# Altium project dAir-aster_0.0.0.2.PrjPCB
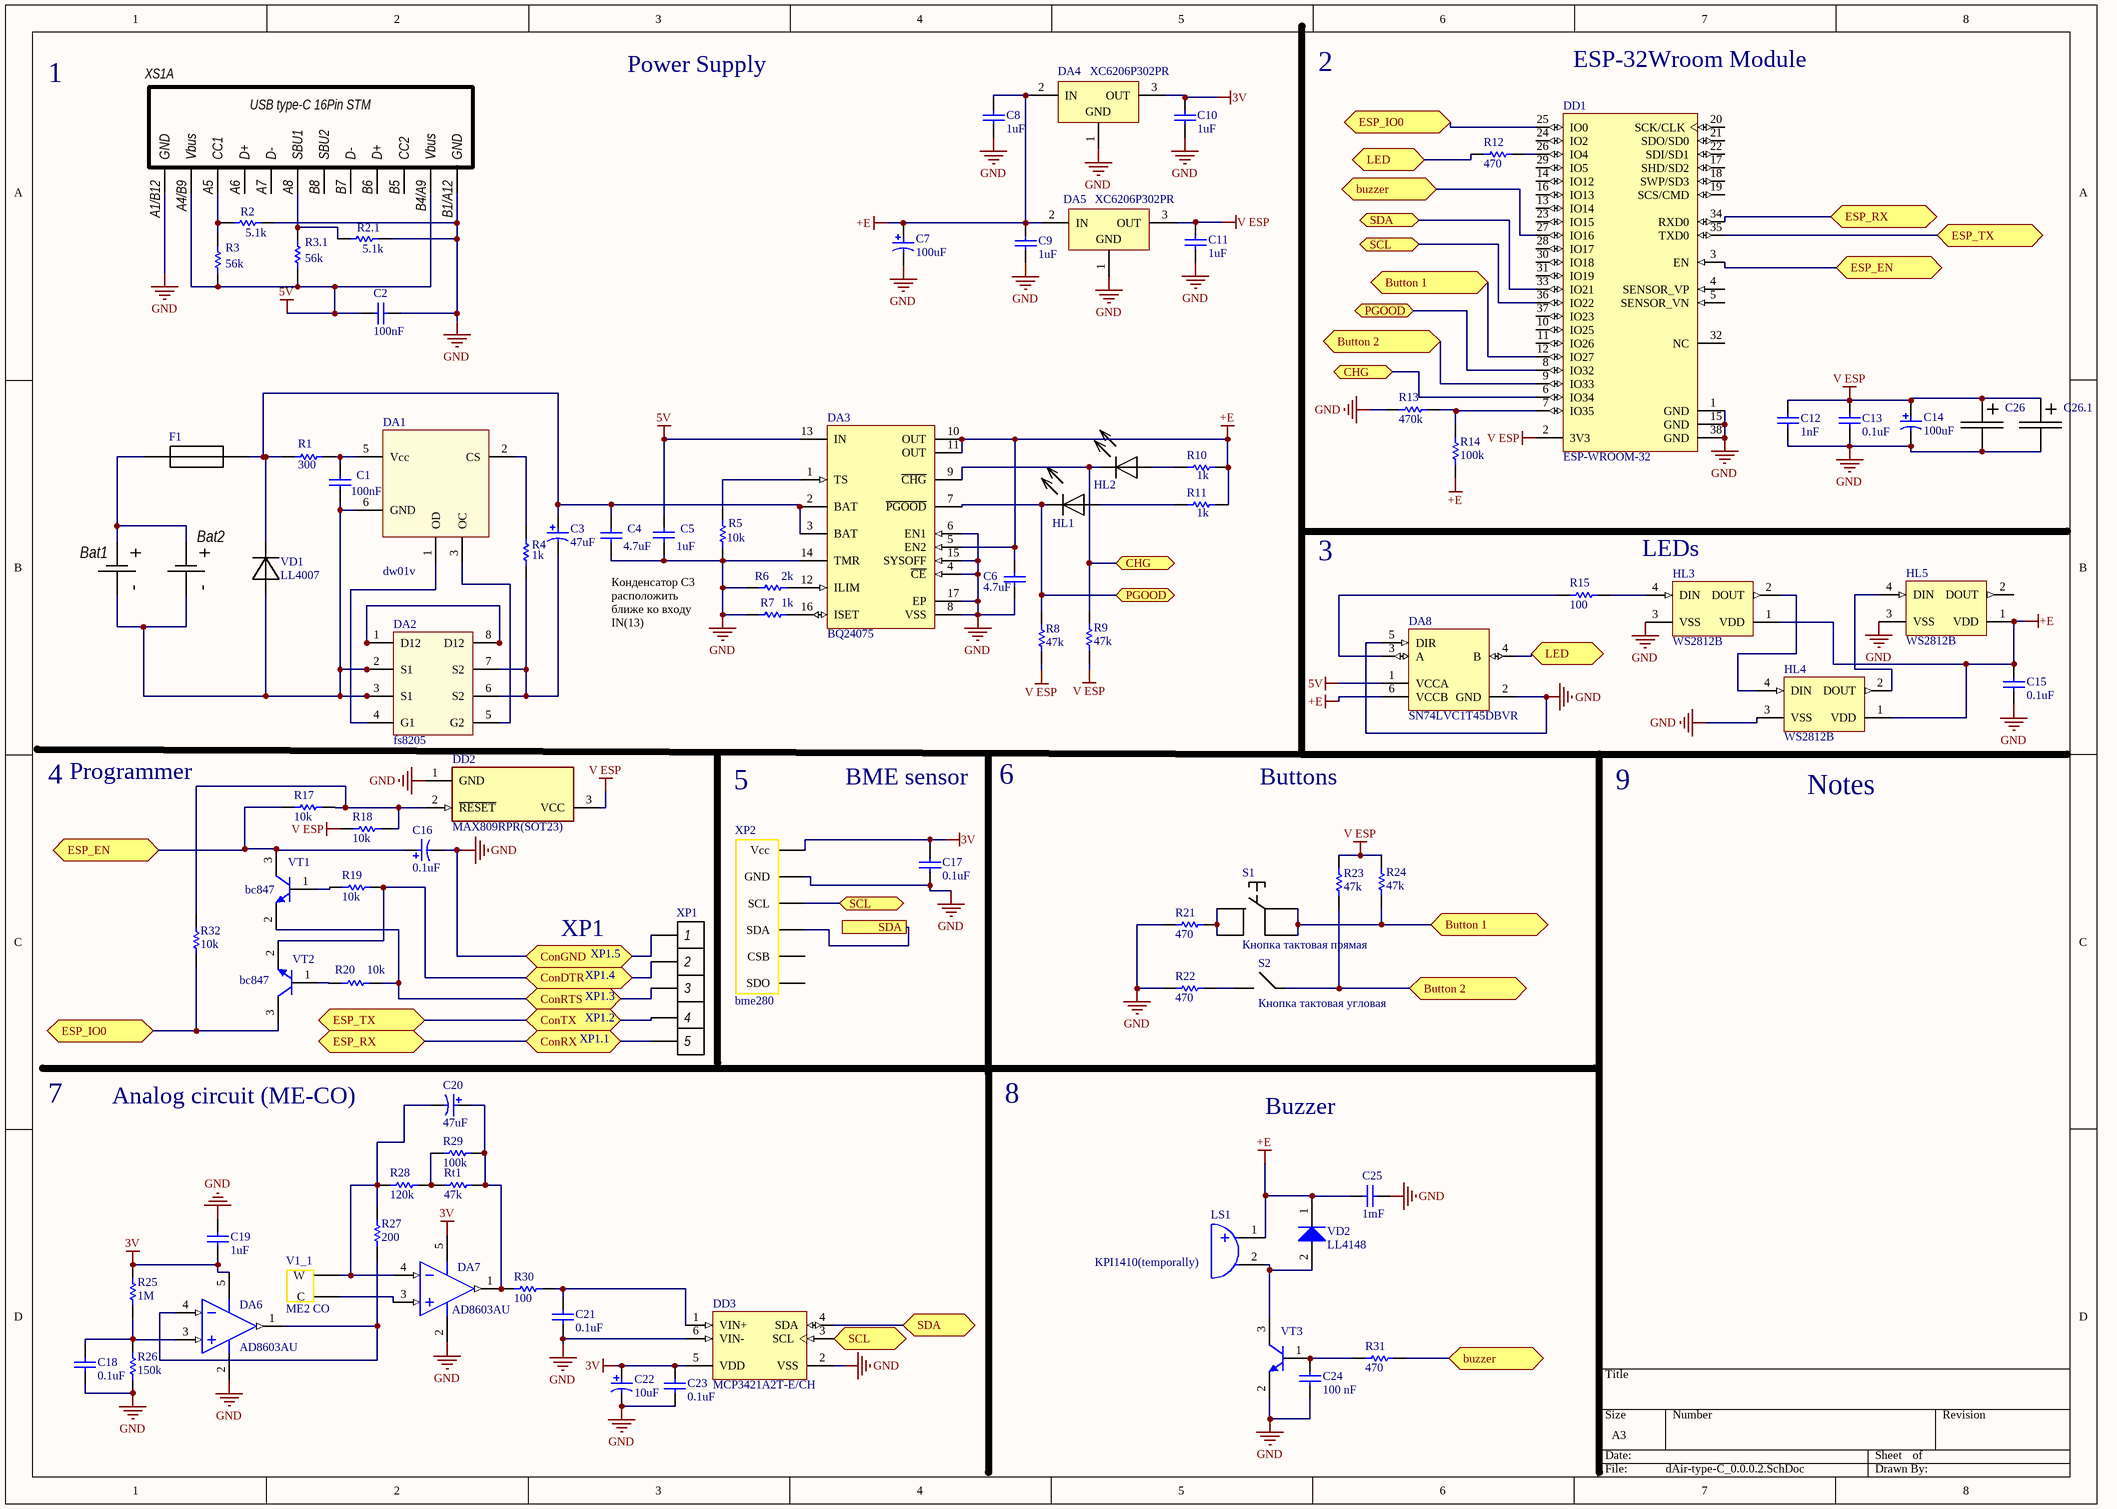
[diagram p0: dAir-type-C_0.0.0.2.SchDoc]
1 sheet, 92 parts. Net scope: flat (ports and power ports of the same name join across sheets).
Board file: dAir_0.0.0.2.PcbDoc

## Sheet dAir-type-C_0.0.0.2.SchDoc
size A3

### Parts
Bat1  *  [Bat_18650_KEYS54]  (value not drawn)
Bat2  АКБ_18650_KEYS54  [Bat_18650_KEYS54]  (value not drawn)
C1  100nF  [CAPC0805(2012)155_L]
C2  100nF  [CAPC0805(2012)155_L]
C3  47uF  [KEMT-A-3216-18-2_M]
C4  4.7uF  [CAPC0805(2012)155_L]
C5  1uF  [CAPC0805(2012)155_L]
C6  4.7uF  [CAPC0805(2012)155_L]
C7  100uF  [KEMT-A-3216-18-2_M]
C8  1uF  [CAPC0805(2012)155_L]
C9  1uF  [CAPC0805(2012)155_L]
C10  1uF  [CAPC0805(2012)155_L]
C11  1uF  [CAPC0805(2012)155_L]
C12  1nF  [CAPC0805(2012)155_L]
C13  0.1uF  [CAPC0805(2012)155_L]
C14  100uF  [KEMT-A-3216-18-2_M]
C15  0.1uF  [CAPC0805(2012)155_L]
C16  0.1uF  [KEMT-A-3216-18-2_M]
C17  0.1uF  [CAPC0805(2012)155_L]
C18  0.1uF  [CAPC0805(2012)155_L]
C19  1uF  [CAPC0805(2012)155_L]
C20  47uF  [KEMT-A-3216-18-2_M]
C21  0.1uF  [CAPC0805(2012)155_L]
C22  10uF  [KEMT-A-3216-18-2_M]
C23  0.1uF  [CAPC0805(2012)155_L]
C24  100 nF  [CAPC0805(2012)155_L]
C25  1mF  [CAPC0805(2012)155_L]
C26  Cap_tantal  [Tantal тип E]  (value not drawn)
C26.1  Cap_electrolitic  [Capacitor_radial_13x21_5mm]  (value not drawn)
DA1  dw01v  [dw01v_SOT-23-6]
DA2  fs8205  [FS8205_TSSOP-8]
DA3  BQ24075  [RGT0016C_V]
DA4  XC6206P302PR  [SOT89_N]
DA5  XC6206P302PR  [SOT89_N]
DA6  AD8603AU  [ADI-UJ-5_M]
DA7  AD8603AU  [ADI-UJ-5_M]
DA8  SN74LVC1T45DBVR  [DBV0006A_L]
DD1  ESP-WROOM-32  [OLMX-ESP-WROOM-32]
DD2  MAX809RPR(SOT23)  [FP-318-08-MFG]
DD3  MCP3421A2T-E/CH  [SOT-23-CH6_L]
F1  Fuse  [FUSE_MF-MSMF050]  (value not drawn)
HL1  HL?  [LED_SMT-3.2x1.6x1.1]  (value not drawn)
HL2  HL?  [LED_SMT-3.2x1.6x1.1]  (value not drawn)
HL3  WS2812B  [ADAI-WS2812B_V]
HL4  WS2812B  [ADAI-WS2812B_V]
HL5  WS2812B  [ADAI-WS2812B_V]
LS1  KPI1410(temporally)  [CZCY-CY-12085G-5042-2_V]
R1  300  [RESC0805(2012)_M]
R2  5.1k  [RESC0805(2012)_M]
R2.1  5.1k  [RESC0805(2012)_M]
R3  56k  [RESC0805(2012)_M]
R3.1  56k  [RESC0805(2012)_M]
R4  1k  [RESC0805(2012)_M]
R5  10k  [RESC0805(2012)_M]
R6  2k  [RESC0805(2012)_M]
R7  1k  [RESC0805(2012)_M]
R8  47k  [RESC0805(2012)_M]
R9  47k  [RESC0805(2012)_M]
R10  1k  [RESC0805(2012)_M]
R11  1k  [RESC0805(2012)_M]
R12  470  [RESC0805(2012)_M]
R13  470k  [RESC0805(2012)_M]
R14  100k  [RESC0805(2012)_M]
R15  100  [RESC0805(2012)_M]
R17  10k  [RESC0805(2012)_M]
R18  10k  [RESC0805(2012)_M]
R19  10k  [RESC0805(2012)_M]
R20  10k  [RESC0805(2012)_M]
R21  470  [RESC0805(2012)_M]
R22  470  [RESC0805(2012)_M]
R23  47k  [RESC0805(2012)_M]
R24  47k  [RESC0805(2012)_M]
R25  1M  [RESC0805(2012)_M]
R26  150k  [RESC0805(2012)_M]
R27  200  [RESC0805(2012)_M]
R28  120k  [RESC0805(2012)_M]
R29  100k  [RESC0805(2012)_M]
R30  100  [RESC0805(2012)_M]
R31  470  [RESC0805(2012)_M]
R32  10k  [RESC0805(2012)_M]
Rt1  47k  [RESC0805(2012)_M]
S1  Кнопка тактовая прямая  [Кнопка тактовая прямая SMT 4.3mm]
S2  Кнопка тактовая угловая  [Кнопка тактовая 4,3мм]
V1_1  ME2 CO  [ME2_CO]
VD1  LL4007  [MELF/DO-213AB]
VD2  LL4148  [INF-SOD323_V]
VT1  bc847  [ONSC-SOT-23-3-318-08_V]
VT2  bc847  [ONSC-SOT-23-3-318-08_V]
VT3  (no value)  [ONSC-SOT-23-3-318-08_V]
XP1  XP1  [Pin 5x2.54]  (value not drawn)
XP2  bme280  [BME680]
XS1A  CON USB_TypeC-16Pin  [USB_type_c_16P_SMT]  (value not drawn)

### Ports
Button 1 (bidir), Button 2 (bidir), buzzer (bidir), CHG (bidir), ConDTR (bidir), ConGND (bidir), ConRTS (bidir), ConRX (bidir), ConTX (bidir), ESP_EN (bidir), ESP_IO0 (bidir), ESP_RX (bidir), ESP_TX (bidir), LED (bidir), PGOOD (bidir), SCL (bidir), SDA, SDA (bidir)

### Nets
3V: C10.2 C17.2 C19.1 C22.1 C23.2 DA4.3(OUT) DA6.5(+V) DA7.5(+V) DD3.5(VDD) R25.2 XP2.1(Vcc)
5V: C2.1 C5.1 DA3.13(IN) DA8.1(VCCA) R3.2 R3.1.2 XS1A.A4/B9(Vbus) XS1A.B4/A9(Vbus)
+E: C6.1 C7.1 C8.2 C9.2 C15.2 C25.1 DA3.5(EN2) DA3.10(OUT) DA3.11(OUT) DA4.2(IN) DA5.2(IN) DA8.6(VCCB) HL3.1(VDD) HL4.1(VDD) HL5.1(VDD) LS1.1(A) R10.1 R11.1 R14.2 VD2.1(K)
GND: C2.2 C4.2 C5.2 C6.2 C7.2 C8.1 C9.1 C10.1 C11.1 C12.1 C13.1 C14.2 C15.1 C16.2 C17.1 C18.1 C19.2 C21.2 C22.2 C23.1 C24.2 C25.2 C26.2(-) C26.1.2(-) DA3.4(~{CE}) DA3.6(EN1) DA3.8(VSS) DA3.14(TMR) DA3.15(SYSOFF) DA3.17(EP) DA4.1(GND) DA5.1(GND) DA6.2(-V) DA7.2(-V) DA8.2(GND) DA8.5(DIR) DD1.1(GND) DD1.15(GND) DD1.38(GND) DD2.1(GND) DD3.2(VSS) DD3.6(VIN-) HL3.3(VSS) HL4.3(VSS) HL5.3(VSS) R2.1 R2.1.1 R5.2 R6.2 R7.2 R13.1 R21.1 R22.1 R26.1 VT3.2(E) XP1.1 XP2.2(GND) XS1A.A1/B12(GND) XS1A.B1/A12(GND) ; port ConGND
V ESP: C11.2 C12.2 C13.2 C14.1 C26.1(+) C26.1.1(+) DA5.3(OUT) DD1.2(3V3) DD2.3(VCC) R8.1 R9.1 R18.2 R23.2 R24.2
NetBat1_1: Bat1.1(Bat+) Bat2.1(Bat+) F1.1
NetBat1_2: Bat1.2(Bat-) Bat2.2(Bat-) C1.2 DA1.6(GND) DA2.2(S1) DA2.3(S1) VD1.2
NetC1_1: C1.1 DA1.5(Vcc) R1.2
NetC3_1: C3.1 C4.1 DA3.2(BAT) DA3.3(BAT) F1.2 R1.1 VD1.1
NetC3_2: C3.2 DA2.6(S2) DA2.7(S2) R4.2
NetC16_1: C16.1 DD1.3(EN) R17.2 VT1.3(C) ; port ESP_EN
NetC18_2: C18.2 DA6.3(+IN) R25.1 R26.2
NetC20_1: C20.1 DA7.1(OUT) R29.2 R30.1 Rt1.2
NetC20_2: C20.2 DA7.4(-IN) R27.2 R28.1 V1_1.1W(W)
NetC21_1: C21.1 DD3.1(VIN+) R30.2
NetC24_1: C24.1 R31.1 VT3.1(B)
NetDA1_1: DA1.1(OD) DA2.4(G1)
NetDA1_2: DA1.2(CS) R4.1
NetDA1_3: DA1.3(OC) DA2.5(G2)
NetDA2_1: DA2.1(D12) DA2.8(D12)
NetDA3_1: DA3.1(TS) R5.1
NetDA3_7: DA3.7(~{PGOOD}) DD1.8(IO32) HL1.1 R8.2 ; port PGOOD
NetDA3_9: DA3.9(~{CHG}) DD1.6(IO34) HL2.1 R9.2 ; port CHG
NetDA3_12: DA3.12(ILIM) R6.1
NetDA3_16: DA3.16(ISET) R7.1
NetDA6_1: DA6.1(OUT) DA6.4(-IN) R27.1
NetDA7_3: DA7.3(+IN) V1_1.2C(C)
NetDA8_3: DA8.3(A) R15.1
NetDA8_4: DA8.4(B) R12.1 ; port LED
NetDD1_7: DD1.7(IO35) R13.2 R14.1
NetDD1_9: DD1.9(IO33) R23.1 S2.2 ; port Button 2
NetDD1_12: DD1.12(IO27) R24.1 S1.3 S1.4 ; port Button 1
NetDD1_25: DD1.25(IO0) R32.1 VT2.3(C) ; port ESP_IO0
NetDD1_26: DD1.26(IO4) R12.2
NetDD1_27: DD1.27(IO16) R31.2 ; port buzzer
NetDD1_33: DD1.33(IO21) DD3.4(SDA) XP2.4(SDA) ; port SDA
NetDD1_34: DD1.34(RXD0) XP1.5 ; port ConRX, port ESP_RX
NetDD1_35: DD1.35(TXD0) XP1.4 ; port ConTX, port ESP_TX
NetDD1_36: DD1.36(IO22) DD3.3(SCL) XP2.3(SCL) ; port SCL
NetDD2_2: DD2.2(~{RESET}) R17.1 R18.1 R32.2
NetHL1_2: HL1.2 R11.2
NetHL2_2: HL2.2 R10.2
NetHL3_2: HL3.2(DOUT) HL4.4(DIN)
NetHL3_4: HL3.4(DIN) R15.2
NetHL4_2: HL4.2(DOUT) HL5.4(DIN)
NetLS1_2: LS1.2(K) VD2.2(A) VT3.3(C)
NetR2.1_2: R2.1.2 R3.1.1 XS1A.A8(SBU1)
NetR2_2: R2.2 R3.1 XS1A.A5(CC1)
NetR19_1: R19.1 VT1.1(B)
NetR19_2: R19.2 VT2.2(E) XP1.2 ; port ConDTR
NetR20_1: R20.1 VT2.1(B)
NetR20_2: R20.2 VT1.2(E) XP1.3 ; port ConRTS
NetR21_2: R21.2 S1.1 S1.2
NetR22_2: R22.2 S2.1
NetR28_2: R28.2 R29.1 Rt1.1
NetS2_3: S2.3 S2.4

Not connected (* = marked no-connect by the designer): DD1 4(SENSOR_VP) 5(SENSOR_VN) 10(IO25) 11(IO26) 13(IO14) 14(IO12) 16(IO13) 17(SHD/SD2) 18(SWP/SD3) 19(SCS/CMD) 20(SCK/CLK) 21(SDO/SD0) 22(SDI/SD1) 23(IO15) 24(IO2) 28(IO17) 29(IO5) 30(IO18) 31(IO19) 32(NC) 37(IO23); HL5 2(DOUT); XP2 5(CSB) 6(SDO); XS1A A6(D+) A7(D-) B5(CC2) B6(D+) B7(D-) B8(SBU2)

### Notes on the sheet
- 1
- Power Supply
- 2
- (near DD1) ESP-32Wroom Module
- 3
- (near HL3) LEDs
- Конденсатор C3 расположить ближе ко входу IN(13)
- 4
- Programmer
- BME sensor
- 6
- Buttons
- 5
- 9
- (near HL4) Notes
- XP1
- XP1.4
- XP1.5
- XP1.1
- XP1.2
- XP1.3
- 7
- Analog circuit (ME-CO)
- 8
- Buzzer
- (in symbol USB_TypeC-16Pin) USB type-C 16Pin STM
- (in symbol АКБ_18650_KEYS54) +; -

### Library data of the parts
Bat1 = АКБ_18650_KEYS54
C1 C2 C4-C6 C8-C13 C15 C17-C19 C21 C23 = CMP-1036-04882-1: CAP 4.7uF 10V ±10% 0805 (2012 Metric) Thickness 1.55mm SMD; Case-EIA: 0805; Tolerance: Â±10%; Case-Metric: 2012; Rated Voltage: 10 V; Max Thickness: 1.55 mm; Technology: SMT; Value: 4.7uF
C3 C7 C14 C16 C20 C22 = CMP-2000-05172-1: Manufacturer Size Code: A; Manufacturer: Kemet; Type: Molded; Online Catalog: T491Series; Other Names: 399-3684-2; Voltage - Rated: 10V; Lifetime @ Temp.: 2000Hrs@85degC; Product Training Modules: CapacitorBasics-TypicalUsesforCapacitorsDeratingGuidelinesforSurfaceMountTantalumCapacitors; ESR (Equivalent Series Resistance): 3.8Ohm; Tolerance: ±10%; Capacitance: 10µF; Catalog Drawings: T49x,T5xxSeries_A-side1T49x,T5xxSeries_A,B-side2T49x,T5xxSeries_A,SBottom; Family: TantalumCapacitors; Manufacturer URL: http://www.kemet.com/; Datasheet URL: http://www.farnell.com/datasheets/1824869.pdf; Package Reference: 1206; Packaging: Tape&Reel(TR); Series: T491; Operating Temperature: -55degC~125degC; Mounting Type: SurfaceMount; Height - Seated (Max): 0.071"(1.80mm); Package / Case: 1206(3216Metric); Package Description: 2-Pin Surface Mount Device, Body 3.2 x 1.6 mm; Features: GeneralPurpose; Lead Spacing: -; Size / Dimension: 0.126"Lx0.063"W(3.20mmx1.60mm); Standard Package: 2,000; Datasheet Version: Apr-14; Category: Capacitors
C24 C25 = CMP-1036-04882-1: CAP 4.7uF 10V ±10% 0805 (2012  Thickness 1.55mm SMD; Case-EIA: 0805; Tolerance: Â±10%; Case-Metric: 2012; Rated Voltage: 10 V; Max Thickness: 1.55 mm; Technology: SMT; Value: 4.7uF
C26 = Cap_electrolitic
DA3 = CMP-0321-00238-2: USB-Friendly Li-Ion Battery Charger and Power-Path Management IC, Vout 5.5 V, 4.3 V, -40 to 85 degC, 16-pin QFN (RGT), Green (RoHS & no Sb/Br); PartNumber: BQ24075RGTR; Manufacturer: Texas Instruments; SubFamily: Battery Charge Management; NiCd: N; Vin(Min)(V): 4.3; Mounting Technology: Surface Mount; PackageDescription: 16-Pin Plastic Quad Flat No-Lead, 3 x 3 mm Body, 0.5 mm Pitch, 1.7 x 1.7 mm Exposed Pad; Over Voltage Protection: N; Code_JEDEC: MO-220; Li-Ion: N; Eco-Plan: Green (RoHS & no Sb/Br); DatasheetVersion: SLUS810G; PackageVersion: revH, Oct-2011; PackageReference: RGT0016C; ComponentLink1URL: http://www.ti.com/general/docs/lit/getliterature.tsp?genericPartNumber=BQ24075&fileType=pdf; Lead Acid: N; ComponentLink1Description: Datasheet; Li-Polymer: N; NiMH: N
DA4 DA5 = CMP-0204-00106-1: 100mA Low Power LDO, Output Voltage 3.0V, SOT89 Pkg; DatasheetVersion: Rev1.80, Mar-2010; PackageDescription: 3-Pin SOT-89 Package 1.5 mm Pitch, 4.1 mm Lead Span; PackageReference: SOT89; PackageVersion: May-2010; Code_IPC: SOT89
DA6 DA7 = CMP-0384-02070-2: Single Channel Single-Supply Operation Operational Amplifier, 400 KHz BW, 100 mV/us SR, Industrial, 5-pin SOT23 (UJ-5), Reel; Manufacturer: Analog Devices; PartNumber: AD8603AUJ-REEL; Generic Part Number: AD8603; Iq/Amp: 50uA; Input Bias Current: 200fA; V Span Min: 1.8V; Small Signal Bandwidth: 400KHz; Input Offset Voltage: 12uV; V Span Max: 6V; Amplifiers Per Package: 1; ComponentLink2Description: Datasheet; RevisionNote: Reference Circuit URL fixed; ComponentLink3URL: http:/www.analog.com/static/imported-files/packages/PKG_PDF/TSOT(UJ)/UJ_5.pdf; ComponentLink1URL: http://www.analog.com/en/index.html; Mounting Technology: Surface Mount; ComponentLink1Description: Manufacturer URL; PackageReference: UJ-5; ComponentLink4Description: Reference Circuit; DatasheetVersion: Rev. C; ComponentLink3Description: Package Specification; PackageVersion: 100708-A; ComponentLink2URL: http://www.analog.com/static/imported-files/data_sheets/AD8603_8607_8609.pdf; PackageDescription: 5-Pin Thin Small Outline Transistor Package, Body 2.9 x 1.6 mm, Pitch 0.95 mm; ComponentLink4URL: http://www.analog.com/en/all-operational-amplifiers-op-amps/operational-amplifiers-op-amps/ad8603/products/product.html#product-recommendations; Code_JEDEC: MO-193-AB; Slew Rate: 100mV/us
DA8 = CMP-0859-00206-3: Single-Bit Dual-Supply Bus Transceiver with Configurable Voltage Translation and 3-State Outputs, DBV0006A, LARGE T&R; Manufacturer: Texas Instruments; VCC(Max)(V): 5.5; Input Type: CMOS/TTL; Technology Family: LVC; Voltage(Nom)(V): 1.8,2.5,3.3,5; ICC @ Nom Voltage(Max)(mA): 0.004; Bits(#): 1; F @ Nom Voltage(Max)(Mhz): 150; Output Drive (IOL/IOH)(Max)(mA): 32/-32; 3-State Output: Yes; Logic: True; Schmitt Trigger: No; Output Type: CMOS; Rating: Catalog; tpd @ Nom Voltage(Max)(ns): 15.5,8,5.8,4.4; VCC(Min)(V): 1.65; Sub-Family: Dual Supply Translator; Generic Part Number: SN74LVC1T45; PackageReference: DBV0006A; DatasheetVersion: SCES515K; Operating Temperature Range(C): -40 to 85
DD1 = CMP-2000-07454-1: Espressif System, 2.7 to 3.6 V, -40 to 85 degC, 38-Pin SMD; Manufacturer: Olimex; Package Description: 38-Pin Surface Mount Device, Body 18 x 25.5 mm, Pitch 1.27 mm; Manufacturer URL: https://www.olimex.com; RoHSCompliant: false; Mounting Technology: SurfaceMount; Datasheet Version: Rev. 2.1, 09/2017; Datasheet URL: http://www.espressif.com/sites/default/files/documentation/esp-wroom-32_datasheet_en.pdf; Package Reference: ESP-WROOM-32
DD2 = CMP-07130-000007-1: IC MPU SUPERVISORY 2.93V SOT23; Manufacturer: ON SEMICONDUCTOR; Manufacturer Part Number: MAX809STRG; Number Of Outputs: 1; Nominal Supply Current: 0.5-0.8uA; Min Supply Voltage: 1V; Max Junction Temp: +125°C; Max Supply Voltage: 5.5V; Reset Timeout: 10us; Output Current: 20mA; Output Voltage: 0.3V; Reset Type: Active Low; Standoff Height: 0.01mm; Octopart: https://octopart.com/max809strg-on+semiconductor-509853; Category: IC; Temperature: -40°C to +125°C; Temperature Range Low: -40°C; ComponentLink2URL: https://www.onsemi.cn/PowerSolutions/document/MAX809S-D.PDF; Device Class L1: Integrated Circuits (ICs); Automotive: No; Package: 318-08; Device Class L2: Power Management ICs; RoHS: TRUE; Height: 1.11mm; Digikey Description: IC MPU SUPERVISORY 2.93V SOT23; Mouser Description: Supervisory Circuits 2.93V uP Reset; ComponentLink2Description: Datasheet; Temperature Range High: +125°C; Number Of Rails Monitored: 1; Threshold Voltage: 2.93V; Footprint Url: https://www.onsemi.com/pub/Collateral/318-08.PDF; Device Class L3: Voltage Supervisors; Lead Free: Yes
DD3 = CMP-0188-00097-2: 18-Bit Analog-to-Digital Converter with I2C Interface and On-Board Reference, 6-Pin SOT-23, Extended Temperature, Tape and Reel; ComponentLink3URL: http://www.microchip.com/stellent/groups/techpub_sg/documents/packagingspec/en012702.pdf; DatasheetVersion: revE, Aug-2009; Code_IPC: SOT26A-6; RevisionNote: URLs added.; ComponentLink2URL: http://ww1.microchip.com/downloads/en/DeviceDoc/22003e.pdf; ComponentLink1URL: http://www.microchip.com/; ComponentLink3Description: Package Specification; ComponentLink2Description: Datasheet; PackageReference: SOT-23-CH6; PackageDescription: 6-Lead Plastic Small Outline Transistor (CH) [SOT-23]; PackageVersion: revBB, Aug-2009; ComponentLink1Description: Manufacturer URL
HL1 HL2 = SMT_LED-3.2x1.6x1.1
HL3-HL5 = CMP-1740-00005-1: Intelligent Control LED Integrated Light Source, 3.5 to 5.3 V, -25 to 80 degC, 4-Pin SMD, RoHS, Bulk; Case\Package: Radial; Shielding: Unshielded; Current Rating: 240 mA; Tolerance: 10%; Mount: Through Hole; Max Operating Temperature: 125 degC; Radiation Hardening: No; Length: 12.2 mm; Min Operating Temperature: -55 degC; ComponentLink1URL: https://www.adafruit.com/; Packaging: Bulk; Lead Pitch: 5 mm; RoHSCompliant: true; Pins: 2; Package Quantity: 200; ComponentLink2URL: https://cdn-shop.adafruit.com/datasheets/WS2812B.pdf; ComponentLink2Description: Datasheet; PackageDescription: 4-Pin Surface Mount Device, Body 5 x 5 mm, Pitch 3.3 mm; PackageReference: WS2812B; Height: 12.2 mm; REACH SVHC: No SVHC; ComponentLink1Description: Manufacturer URL; DatasheetVersion: May-13
LS1 = CMP-1019-00001-1: Buzzer, 5 V, 42 Ohm, -20 to 70 degC, 2-Pin THD, Dia 12 mm, Height 8.5 mm, RoHS, Tray; PartNumber: cy-12085G-5042; Manufacturer: Changzhou Chaoyin; Oscillation Frequency: 2.048 KHz; Rated Voltage: 5 V; Current Consumption (Max.): 35 mA; Resistance Value: 42 +/- 4 Ohm; Sound Pressure Level (Min.): 85 dB; PackageReference: CY-12085G-5042; Mounting Technology: Through Hole; Packing: Tray; RoHS: TRUE; Operating Temperature Range: -20 to 70 degC; PackageDescription: 2-Pin Through-hole Buzzer, Dia 12 mm, Height 8.5 mm
R1 R2 R2.1 R3 R3.1 R4-R15 R17-R32 Rt1 = CMP-1013-00017-1: Value: 4.30 Ohm; Tolerance: 5 %; Power: 0.125 W; Case-Metric: 2012; Case-EIA: 0805; Technology: SMT
VD2 = CMP-1182-00006-1: Silicon Schottky Diode, SOD323, Reel, Green; Manufacturer: Infineon; PartNumber: BAT 54-03W E6327; Green: TRUE; ComponentLink1Description: Manufacturer URL; ComponentLink1URL: http://www.infineon.com/; PackageReference: SOD323; Packing: Reel; PackageDescription: 2-Pin Small Outline Diode Package, 1.25 x 1.7 mm Body; ComponentLink2Description: Datasheet; Mounting Technology: Surface Mount; ComponentLink3URL: http://www.infineon.com/dgdl/SOD323-Package_Overview.pdf?folderId=db3a30431936bc4b011952aab84f3bbe&fileId=db3a30431936bc4b011952beed653be3; ComponentLink3Description: Package Specification; ComponentLink2URL: http://www.infineon.com/dgdl/bat54series.pdf?folderId=db3a30431400ef68011425f1ca2505e3&fileId=db3a304314dca3890115190b74210ea6; RevisionNote: Lost Devices pt2
VT1-VT3 = CMP-1048-00737-1: General Purpose Transistor, NPN Silicon, 3-Pin SOT-23, Pb-Free, Tape and Reel; Manufacturer: On Semiconductor; PartNumber: BC817-25LT1G; IC Continuous (A): 0.5; fT Min (MHz): 100; PackageDescription: 3-Pin Small Outline Transistor, Body 2.92 x 1.3 mm, Pitch 0.95 mm; ComponentLink3Description: Package Specification; ComponentLink2Description: Datasheet; RoHS: TRUE; PackageVersion: Rev. AP, 11/2009; ComponentLink1URL: http://www.onsemi.com/; PackageReference: SOT-23-3-318-08; ComponentLink3URL: http://www.onsemi.cn/pub_link/Collateral/318-08.PDF; ComponentLink2URL: http://www.onsemi.com/pub_link/Collateral/BC817-16LT1-D.PDF; Mounting Technology: Surface Mount; Packing: Tape and Reel; DatasheetVersion: Rev. 12; Polarity: NPN; ComponentLink1Description: Manufacturer URL
XP1 = Pin 5x2.54mm
XS1A = USB_TypeC-16Pin: ST1S10PHR: *